# Altium schematic sheet Display.SchDoc
size A4; SheetNumber: 5; SheetTotal: 5
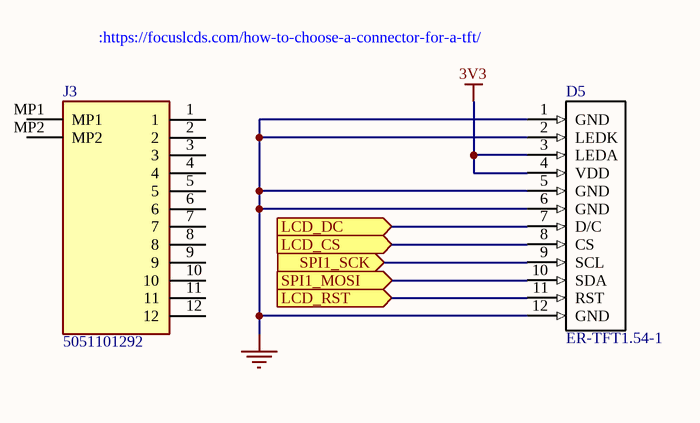
[diagram p0: Display.SchDoc]

## Parts
D5  ER-TFT1.54-1  [IPS 1.54 inches]
J3  5051101292  [5051101292]

## Ports
LCD_CS (in, see DriverFitTracker[2B]), LCD_DC (in, see DriverFitTracker[2B]), LCD_RST (in, see DriverFitTracker[2B]), SPI1_MOSI (in, see DriverFitTracker[2B]), SPI1_SCK (in, see DriverFitTracker[2B])

## Nets
3V3: D5.3(LEDA) D5.4(VDD)
GND: D5.1(GND) D5.2(LEDK) D5.5(GND) D5.6(GND) D5.12(GND)
LCD_CS: D5.8(CS) ; port LCD_CS
LCD_DC: D5.7(D/C) ; port LCD_DC
LCD_RST: D5.11(RST) ; port LCD_RST
SPI1_MOSI: D5.10(SDA) ; port SPI1_MOSI
SPI1_SCK: D5.9(SCL) ; port SPI1_SCK

Not connected (* = marked no-connect by the designer): J3 1 2 3 4 5 6 7 8 9 10 11 12 MP1 MP2

## Notes on the sheet
- :https://focuslcds.com/how-to-choose-a-connector-for-a-tft/

## Library data of the parts
D5 = IPS 1.54 inch: IPS display 1.54 inch SPI
J3 = 5051101292: CONN FPC BOTTOM 12POS .5MM R/A; Manufacturer_Name: Molex; Geometry.Height: 2.1mm; Manufacturer_Part_Number: 5051101292; Mouser Part Number: *; Mouser Price/Stock: *; Arrow Part Number: 5051101292; Arrow Price/Stock: https://www.arrow.com/en/products/505110-1292/molex?region=nac; Datasheet Link: https://www.molex.com/pdm_docs/sd/5051101292_sd.pdf